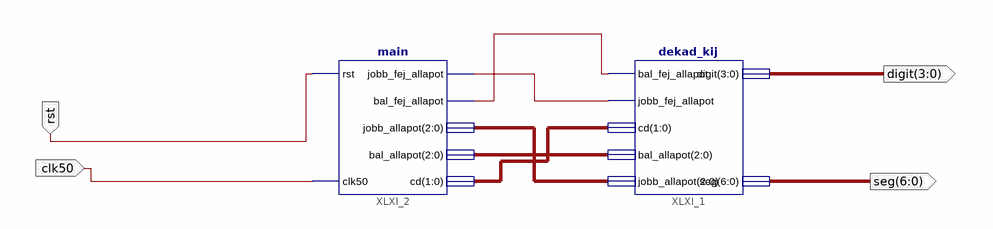
[diagram p0: schematic sheet 1]
// Xilinx ISE schematic dirII_hazi.sch (spartan3e) as structural Verilog: 2 symbols, 4 ports
module dirII_hazi (
  input  rst,
  input  clk50,
  output [3:0] digit,
  output [6:0] seg
);

  wire XLXN_19, XLXN_20;
  wire [1:0] XLXN_21;
  wire [2:0] XLXN_22, XLXN_23;

  dekad_kij XLXI_1 (
    .bal_fej_allapot(XLXN_20), .jobb_fej_allapot(XLXN_19), .cd(XLXN_21), .bal_allapot(XLXN_23),
    .jobb_allapot(XLXN_22), .digit(digit), .seg(seg));
  main XLXI_2 (
    .rst(rst), .clk50(clk50), .jobb_fej_allapot(XLXN_19), .bal_fej_allapot(XLXN_20), .jobb_allapot(XLXN_22),
    .bal_allapot(XLXN_23), .cd(XLXN_21));
endmodule
